# Altium schematic sheet HashUnit1.SchDoc: ANT_Miner_V1.3
size A2; Date: 2013/11/20; DrawnBy: Bitmain Technology; SheetNumber: 6; SheetTotal: 9
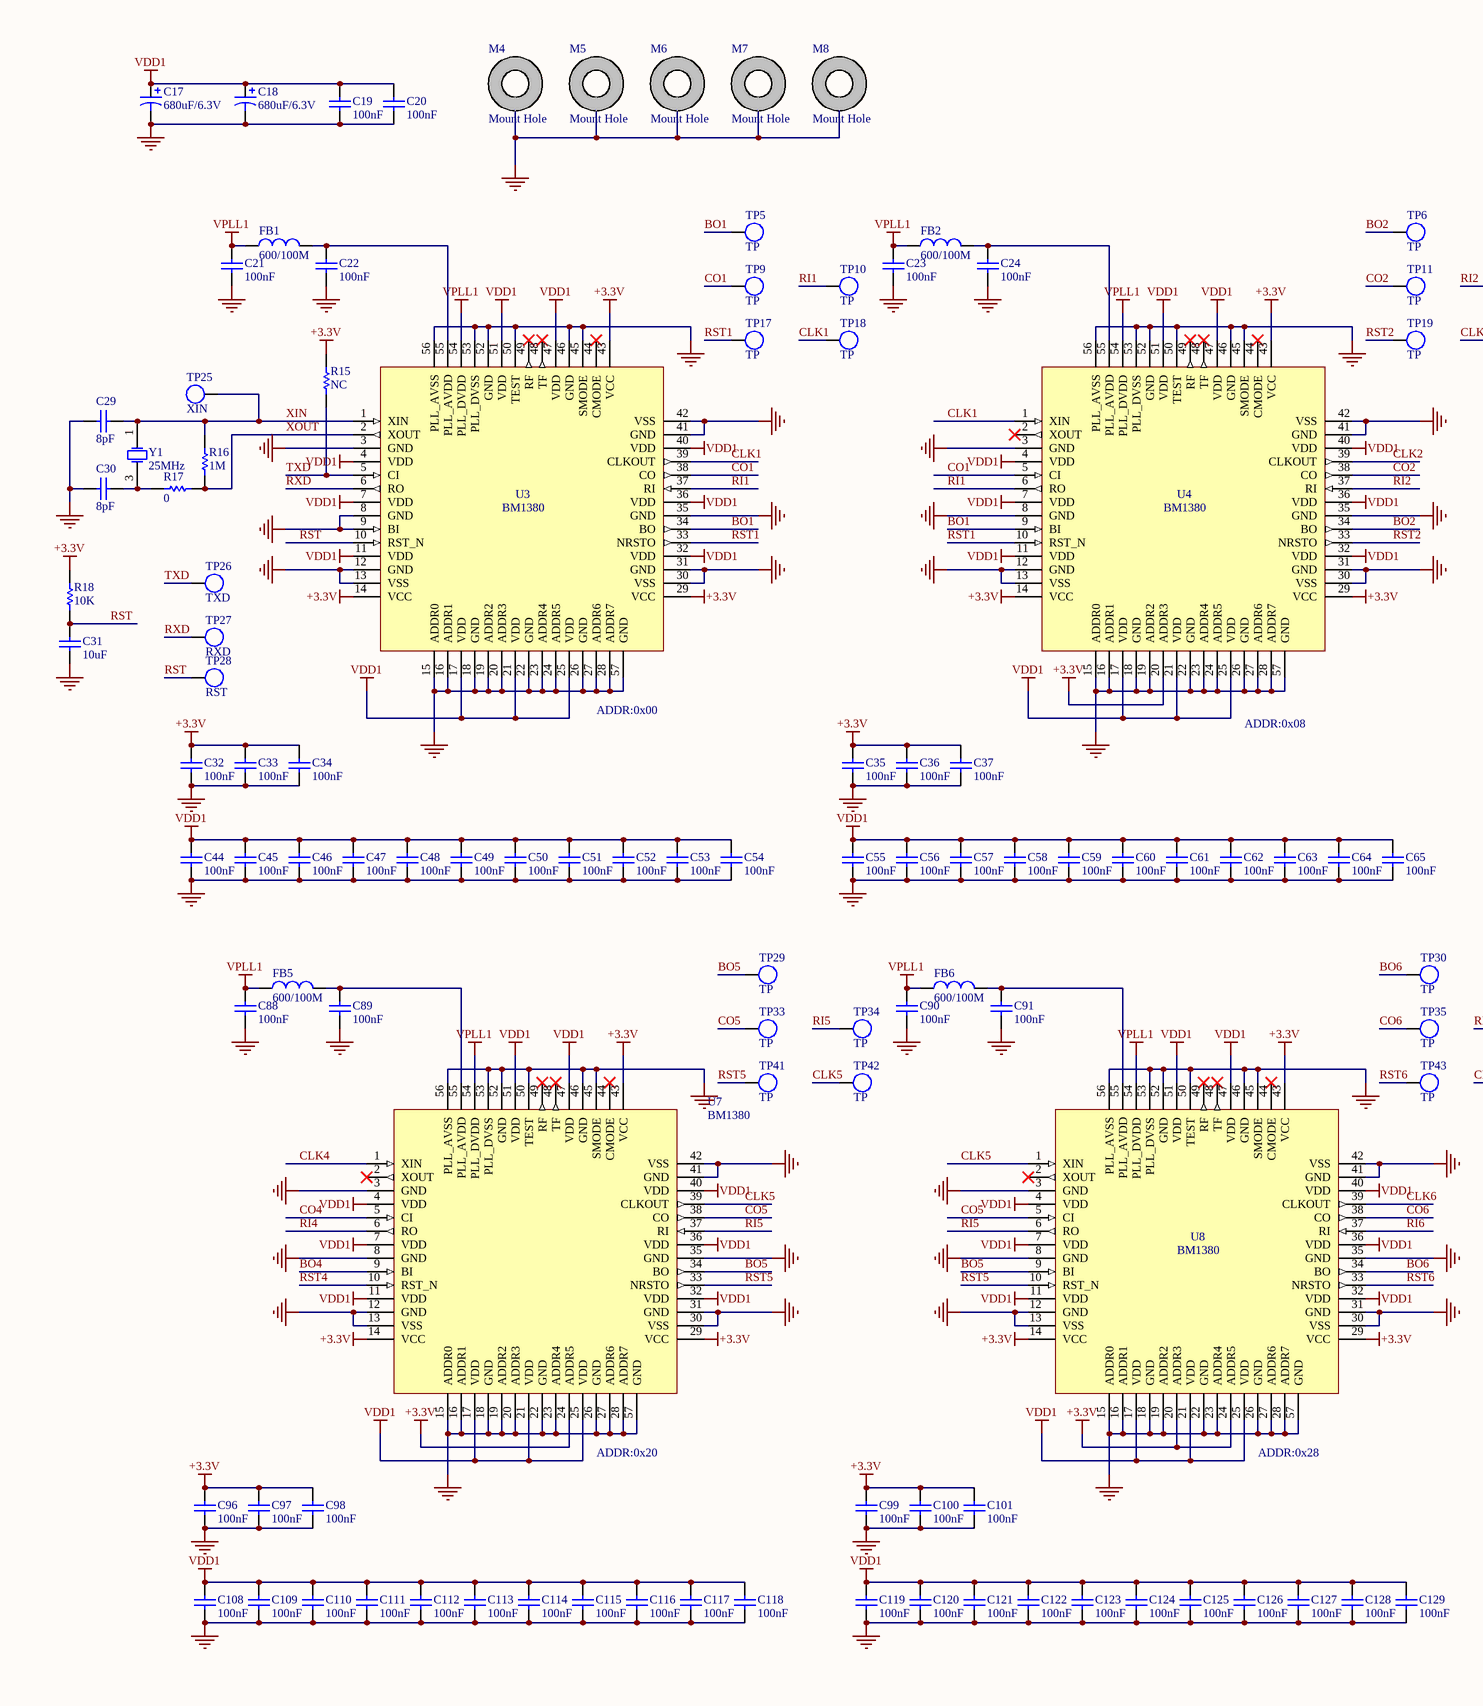
[diagram p0: HashUnit1.SchDoc, left]
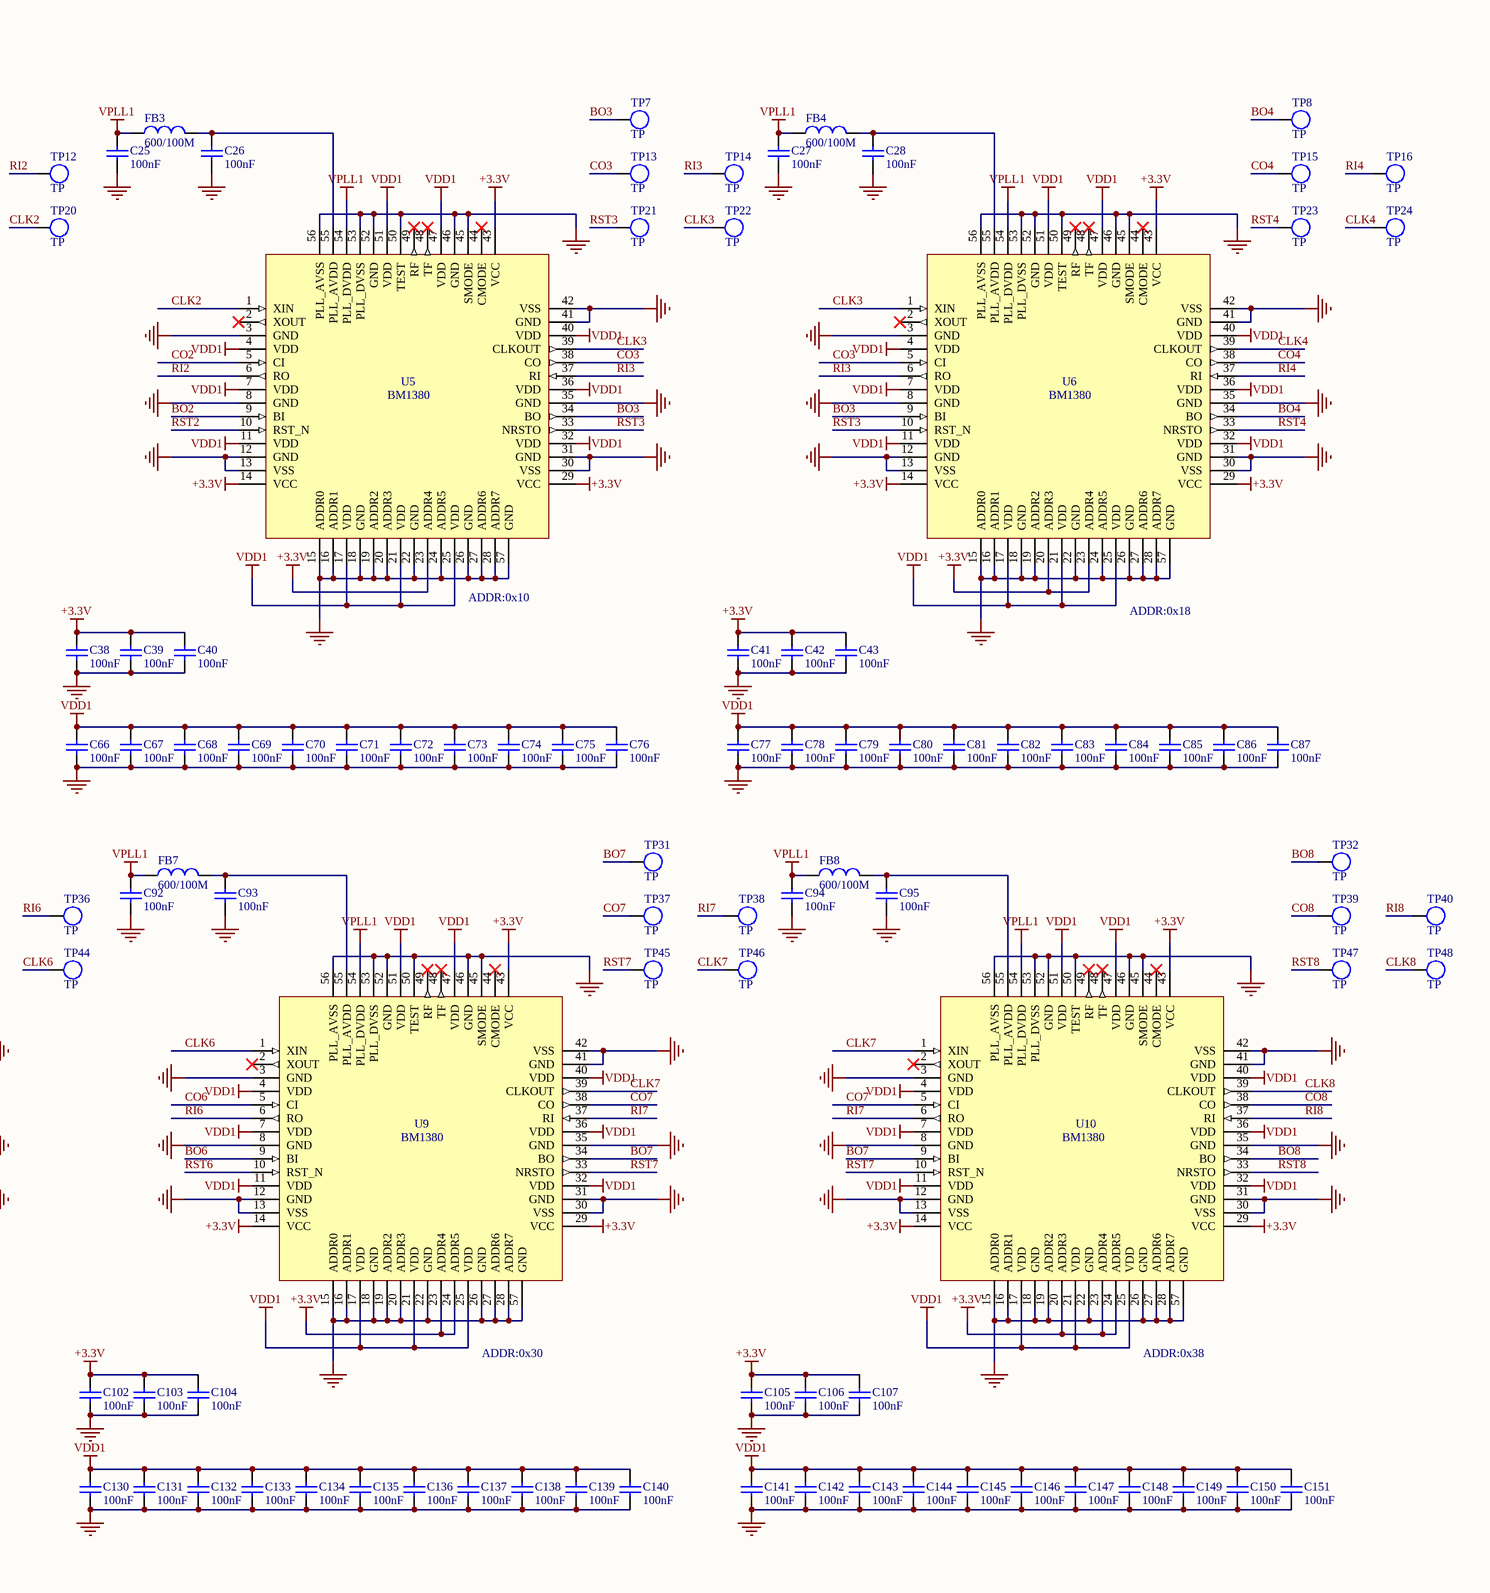
[diagram p1: HashUnit1.SchDoc, right]

## Parts
C17  680uF/6.3V  [D]
C18  680uF/6.3V  [D]
C19  100nF  [CC0603(1608)]
C20  100nF  [CC0603(1608)]
C21  100nF  [CC0603(1608)]
C22  100nF  [CC0603(1608)]
C23  100nF  [CC0603(1608)]
C24  100nF  [CC0603(1608)]
C25  100nF  [CC0603(1608)]
C26  100nF  [CC0603(1608)]
C27  100nF  [CC0603(1608)]
C28  100nF  [CC0603(1608)]
C29  8pF  [CC0603(1608)]
C30  8pF  [CC0603(1608)]
C31  10uF  [CC0603(1608)]
C32  100nF  [CC0603(1608)]
C33  100nF  [CC0603(1608)]
C34  100nF  [CC0603(1608)]
C35  100nF  [CC0603(1608)]
C36  100nF  [CC0603(1608)]
C37  100nF  [CC0603(1608)]
C38  100nF  [CC0603(1608)]
C39  100nF  [CC0603(1608)]
C40  100nF  [CC0603(1608)]
C41  100nF  [CC0603(1608)]
C42  100nF  [CC0603(1608)]
C43  100nF  [CC0603(1608)]
C44  100nF  [CC0603(1608)]
C45  100nF  [CC0603(1608)]
C46  100nF  [CC0603(1608)]
C47  100nF  [CC0603(1608)]
C48  100nF  [CC0603(1608)]
C49  100nF  [CC0603(1608)]
C50  100nF  [CC0603(1608)]
C51  100nF  [CC0603(1608)]
C52  100nF  [CC0603(1608)]
C53  100nF  [CC0603(1608)]
C54  100nF  [CC0603(1608)]
C55  100nF  [CC0603(1608)]
C56  100nF  [CC0603(1608)]
C57  100nF  [CC0603(1608)]
C58  100nF  [CC0603(1608)]
C59  100nF  [CC0603(1608)]
C60  100nF  [CC0603(1608)]
C61  100nF  [CC0603(1608)]
C62  100nF  [CC0603(1608)]
C63  100nF  [CC0603(1608)]
C64  100nF  [CC0603(1608)]
C65  100nF  [CC0603(1608)]
C66  100nF  [CC0603(1608)]
C67  100nF  [CC0603(1608)]
C68  100nF  [CC0603(1608)]
C69  100nF  [CC0603(1608)]
C70  100nF  [CC0603(1608)]
C71  100nF  [CC0603(1608)]
C72  100nF  [CC0603(1608)]
C73  100nF  [CC0603(1608)]
C74  100nF  [CC0603(1608)]
C75  100nF  [CC0603(1608)]
C76  100nF  [CC0603(1608)]
C77  100nF  [CC0603(1608)]
C78  100nF  [CC0603(1608)]
C79  100nF  [CC0603(1608)]
C80  100nF  [CC0603(1608)]
C81  100nF  [CC0603(1608)]
C82  100nF  [CC0603(1608)]
C83  100nF  [CC0603(1608)]
C84  100nF  [CC0603(1608)]
C85  100nF  [CC0603(1608)]
C86  100nF  [CC0603(1608)]
C87  100nF  [CC0603(1608)]
C88  100nF  [CC0603(1608)]
C89  100nF  [CC0603(1608)]
C90  100nF  [CC0603(1608)]
C91  100nF  [CC0603(1608)]
C92  100nF  [CC0603(1608)]
C93  100nF  [CC0603(1608)]
C94  100nF  [CC0603(1608)]
C95  100nF  [CC0603(1608)]
C96  100nF  [CC0603(1608)]
C97  100nF  [CC0603(1608)]
C98  100nF  [CC0603(1608)]
C99  100nF  [CC0603(1608)]
C100  100nF  [CC0603(1608)]
C101  100nF  [CC0603(1608)]
C102  100nF  [CC0603(1608)]
C103  100nF  [CC0603(1608)]
C104  100nF  [CC0603(1608)]
C105  100nF  [CC0603(1608)]
C106  100nF  [CC0603(1608)]
C107  100nF  [CC0603(1608)]
C108  100nF  [CC0603(1608)]
C109  100nF  [CC0603(1608)]
C110  100nF  [CC0603(1608)]
C111  100nF  [CC0603(1608)]
C112  100nF  [CC0603(1608)]
C113  100nF  [CC0603(1608)]
C114  100nF  [CC0603(1608)]
C115  100nF  [CC0603(1608)]
C116  100nF  [CC0603(1608)]
C117  100nF  [CC0603(1608)]
C118  100nF  [CC0603(1608)]
C119  100nF  [CC0603(1608)]
C120  100nF  [CC0603(1608)]
C121  100nF  [CC0603(1608)]
C122  100nF  [CC0603(1608)]
C123  100nF  [CC0603(1608)]
C124  100nF  [CC0603(1608)]
C125  100nF  [CC0603(1608)]
C126  100nF  [CC0603(1608)]
C127  100nF  [CC0603(1608)]
C128  100nF  [CC0603(1608)]
C129  100nF  [CC0603(1608)]
C130  100nF  [CC0603(1608)]
C131  100nF  [CC0603(1608)]
C132  100nF  [CC0603(1608)]
C133  100nF  [CC0603(1608)]
C134  100nF  [CC0603(1608)]
C135  100nF  [CC0603(1608)]
C136  100nF  [CC0603(1608)]
C137  100nF  [CC0603(1608)]
C138  100nF  [CC0603(1608)]
C139  100nF  [CC0603(1608)]
C140  100nF  [CC0603(1608)]
C141  100nF  [CC0603(1608)]
C142  100nF  [CC0603(1608)]
C143  100nF  [CC0603(1608)]
C144  100nF  [CC0603(1608)]
C145  100nF  [CC0603(1608)]
C146  100nF  [CC0603(1608)]
C147  100nF  [CC0603(1608)]
C148  100nF  [CC0603(1608)]
C149  100nF  [CC0603(1608)]
C150  100nF  [CC0603(1608)]
C151  100nF  [CC0603(1608)]
FB1  600/100M  [FB0603(1608)]
FB2  600/100M  [FB0603(1608)]
FB3  600/100M  [FB0603(1608)]
FB4  600/100M  [FB0603(1608)]
FB5  600/100M  [FB0603(1608)]
FB6  600/100M  [FB0603(1608)]
FB7  600/100M  [FB0603(1608)]
FB8  600/100M  [FB0603(1608)]
M4  Mount Hole  [MHOLE2]
M5  Mount Hole  [MHOLE2]
M6  Mount Hole  [MHOLE2]
M7  Mount Hole  [MHOLE2]
M8  Mount Hole  [MHOLE2]
R15  NC  [RR0603(1608)]
R16  1M  [RR0603(1608)]
R17  0  [RR0603(1608)]
R18  10K  [RR0603(1608)]
TP5  TP  [TP_SMD]
TP6  TP  [TP_SMD]
TP7  TP  [TP_SMD]
TP8  TP  [TP_SMD]
TP9  TP  [TP_SMD]
TP10  TP  [TP_SMD]
TP11  TP  [TP_SMD]
TP12  TP  [TP_SMD]
TP13  TP  [TP_SMD]
TP14  TP  [TP_SMD]
TP15  TP  [TP_SMD]
TP16  TP  [TP_SMD]
TP17  TP  [TP_SMD]
TP18  TP  [TP_SMD]
TP19  TP  [TP_SMD]
TP20  TP  [TP_SMD]
TP21  TP  [TP_SMD]
TP22  TP  [TP_SMD]
TP23  TP  [TP_SMD]
TP24  TP  [TP_SMD]
TP25  value XIN  [TP_SMD]  (hidden comment: TP)
TP26  value TXD  [TP_SMD]  (hidden comment: TP)
TP27  value RXD  [TP_SMD]  (hidden comment: TP)
TP28  value RST  [TP_SMD]  (hidden comment: TP)
TP29  TP  [TP_SMD]
TP30  TP  [TP_SMD]
TP31  TP  [TP_SMD]
TP32  TP  [TP_SMD]
TP33  TP  [TP_SMD]
TP34  TP  [TP_SMD]
TP35  TP  [TP_SMD]
TP36  TP  [TP_SMD]
TP37  TP  [TP_SMD]
TP38  TP  [TP_SMD]
TP39  TP  [TP_SMD]
TP40  TP  [TP_SMD]
TP41  TP  [TP_SMD]
TP42  TP  [TP_SMD]
TP43  TP  [TP_SMD]
TP44  TP  [TP_SMD]
TP45  TP  [TP_SMD]
TP46  TP  [TP_SMD]
TP47  TP  [TP_SMD]
TP48  TP  [TP_SMD]
U3  BM1380  [QFN56]
U4  BM1380  [QFN56]
U5  BM1380  [QFN56]
U6  BM1380  [QFN56]
U7  BM1380  [QFN56]
U8  BM1380  [QFN56]
U9  BM1380  [QFN56]
U10  BM1380  [QFN56]
Y1  25MHz  [SMX2]

## Nets
+3.3V: C32.2 C33.2 C34.2 C35.2 C36.2 C37.2 C38.2 C39.2 C40.2 C41.2 C42.2 C43.2 C96.2 C97.2 C98.2 C99.2 C100.2 C101.2 C102.2 C103.2 C104.2 C105.2 C106.2 C107.2 R15.1 R18.2 U3.14(VCC) U3.29(VCC) U3.43(VCC) U4.14(VCC) U4.20(ADDR3) U4.29(VCC) U4.43(VCC) U5.14(VCC) U5.23(ADDR4) U5.29(VCC) U5.43(VCC) U6.14(VCC) U6.20(ADDR3) U6.23(ADDR4) U6.29(VCC) U6.43(VCC) U7.14(VCC) U7.24(ADDR5) U7.29(VCC) U7.43(VCC) U8.14(VCC) U8.20(ADDR3) U8.24(ADDR5) U8.29(VCC) U8.43(VCC) U9.14(VCC) U9.23(ADDR4) U9.24(ADDR5) U9.29(VCC) U9.43(VCC) U10.14(VCC) U10.20(ADDR3) U10.23(ADDR4) U10.24(ADDR5) U10.29(VCC) U10.43(VCC)
GND: C17.2 C18.2 C19.1 C20.1 C21.2 C22.1 C23.2 C24.1 C25.2 C26.1 C27.2 C28.1 C29.2 C30.2 C31.2 C32.1 C33.1 C34.1 C35.1 C36.1 C37.1 C38.1 C39.1 C40.1 C41.1 C42.1 C43.1 C44.1 C45.1 C46.1 C47.1 C48.1 C49.1 C50.1 C51.1 C52.1 C53.1 C54.1 C55.1 C56.1 C57.1 C58.1 C59.1 C60.1 C61.1 C62.1 C63.1 C64.1 C65.1 C66.1 C67.1 C68.1 C69.1 C70.1 C71.1 C72.1 C73.1 C74.1 C75.1 C76.1 C77.1 C78.1 C79.1 C80.1 C81.1 C82.1 C83.1 C84.1 C85.1 C86.1 C87.1 C88.2 C89.1 C90.2 C91.1 C92.2 C93.1 C94.2 C95.1 C96.1 C97.1 C98.1 C99.1 C100.1 C101.1 C102.1 C103.1 C104.1 C105.1 C106.1 C107.1 C108.1 C109.1 C110.1 C111.1 C112.1 C113.1 C114.1 C115.1 C116.1 C117.1 C118.1 C119.1 C120.1 C121.1 C122.1 C123.1 C124.1 C125.1 C126.1 C127.1 C128.1 C129.1 C130.1 C131.1 C132.1 C133.1 C134.1 C135.1 C136.1 C137.1 C138.1 C139.1 C140.1 C141.1 C142.1 C143.1 C144.1 C145.1 C146.1 C147.1 C148.1 C149.1 C150.1 C151.1 M4.0(PIN) M5.0(PIN) M6.0(PIN) M7.0(PIN) M8.0(PIN) U3.3(GND) U3.8(GND) U3.9(BI) U3.12(GND) U3.13(VSS) U3.15(ADDR0) U3.16(ADDR1) U3.18(GND) U3.19(ADDR2) U3.20(ADDR3) U3.22(GND) U3.23(ADDR4) U3.24(ADDR5) U3.26(GND) U3.27(ADDR6) U3.28(ADDR7) U3.30(VSS) U3.31(GND) U3.35(GND) U3.41(GND) U3.42(VSS) U3.45(SMODE) U3.46(GND) U3.50(TEST) U3.52(GND) U3.53(PLL_DVSS) U3.56(PLL_AVSS) U3.57(GND) U4.3(GND) U4.8(GND) U4.12(GND) U4.13(VSS) U4.15(ADDR0) U4.16(ADDR1) U4.18(GND) U4.19(ADDR2) U4.22(GND) U4.23(ADDR4) U4.24(ADDR5) U4.26(GND) U4.27(ADDR6) U4.28(ADDR7) U4.30(VSS) U4.31(GND) U4.35(GND) U4.41(GND) U4.42(VSS) U4.45(SMODE) U4.46(GND) U4.50(TEST) U4.52(GND) U4.53(PLL_DVSS) U4.56(PLL_AVSS) U4.57(GND) U5.3(GND) U5.8(GND) U5.12(GND) U5.13(VSS) U5.15(ADDR0) U5.16(ADDR1) U5.18(GND) U5.19(ADDR2) U5.20(ADDR3) U5.22(GND) U5.24(ADDR5) U5.26(GND) U5.27(ADDR6) U5.28(ADDR7) U5.30(VSS) U5.31(GND) U5.35(GND) U5.41(GND) U5.42(VSS) U5.45(SMODE) U5.46(GND) U5.50(TEST) U5.52(GND) U5.53(PLL_DVSS) U5.56(PLL_AVSS) U5.57(GND) U6.3(GND) U6.8(GND) U6.12(GND) U6.13(VSS) U6.15(ADDR0) U6.16(ADDR1) U6.18(GND) U6.19(ADDR2) U6.22(GND) U6.24(ADDR5) U6.26(GND) U6.27(ADDR6) U6.28(ADDR7) U6.30(VSS) U6.31(GND) U6.35(GND) U6.41(GND) U6.42(VSS) U6.45(SMODE) U6.46(GND) U6.50(TEST) U6.52(GND) U6.53(PLL_DVSS) U6.56(PLL_AVSS) U6.57(GND) U7.3(GND) U7.8(GND) U7.12(GND) U7.13(VSS) U7.15(ADDR0) U7.16(ADDR1) U7.18(GND) U7.19(ADDR2) U7.20(ADDR3) U7.22(GND) U7.23(ADDR4) U7.26(GND) U7.27(ADDR6) U7.28(ADDR7) U7.30(VSS) U7.31(GND) U7.35(GND) U7.41(GND) U7.42(VSS) U7.45(SMODE) U7.46(GND) U7.50(TEST) U7.52(GND) U7.53(PLL_DVSS) U7.56(PLL_AVSS) U7.57(GND) U8.3(GND) U8.8(GND) U8.12(GND) U8.13(VSS) U8.15(ADDR0) U8.16(ADDR1) U8.18(GND) U8.19(ADDR2) U8.22(GND) U8.23(ADDR4) U8.26(GND) U8.27(ADDR6) U8.28(ADDR7) U8.30(VSS) U8.31(GND) U8.35(GND) U8.41(GND) U8.42(VSS) U8.45(SMODE) U8.46(GND) U8.50(TEST) U8.52(GND) U8.53(PLL_DVSS) U8.56(PLL_AVSS) U8.57(GND) U9.3(GND) U9.8(GND) U9.12(GND) U9.13(VSS) U9.15(ADDR0) U9.16(ADDR1) U9.18(GND) U9.19(ADDR2) U9.20(ADDR3) U9.22(GND) U9.26(GND) U9.27(ADDR6) U9.28(ADDR7) U9.30(VSS) U9.31(GND) U9.35(GND) U9.41(GND) U9.42(VSS) U9.45(SMODE) U9.46(GND) U9.50(TEST) U9.52(GND) U9.53(PLL_DVSS) U9.56(PLL_AVSS) U9.57(GND) U10.3(GND) U10.8(GND) U10.12(GND) U10.13(VSS) U10.15(ADDR0) U10.16(ADDR1) U10.18(GND) U10.19(ADDR2) U10.22(GND) U10.26(GND) U10.27(ADDR6) U10.28(ADDR7) U10.30(VSS) U10.31(GND) U10.35(GND) U10.41(GND) U10.42(VSS) U10.45(SMODE) U10.46(GND) U10.50(TEST) U10.52(GND) U10.53(PLL_DVSS) U10.56(PLL_AVSS) U10.57(GND)
VDD1: C17.1 C18.1 C19.2 C20.2 C44.2 C45.2 C46.2 C47.2 C48.2 C49.2 C50.2 C51.2 C52.2 C53.2 C54.2 C55.2 C56.2 C57.2 C58.2 C59.2 C60.2 C61.2 C62.2 C63.2 C64.2 C65.2 C66.2 C67.2 C68.2 C69.2 C70.2 C71.2 C72.2 C73.2 C74.2 C75.2 C76.2 C77.2 C78.2 C79.2 C80.2 C81.2 C82.2 C83.2 C84.2 C85.2 C86.2 C87.2 C108.2 C109.2 C110.2 C111.2 C112.2 C113.2 C114.2 C115.2 C116.2 C117.2 C118.2 C119.2 C120.2 C121.2 C122.2 C123.2 C124.2 C125.2 C126.2 C127.2 C128.2 C129.2 C130.2 C131.2 C132.2 C133.2 C134.2 C135.2 C136.2 C137.2 C138.2 C139.2 C140.2 C141.2 C142.2 C143.2 C144.2 C145.2 C146.2 C147.2 C148.2 C149.2 C150.2 C151.2 U3.4(VDD) U3.7(VDD) U3.11(VDD) U3.17(VDD) U3.21(VDD) U3.25(VDD) U3.32(VDD) U3.36(VDD) U3.40(VDD) U3.47(VDD) U3.51(VDD) U4.4(VDD) U4.7(VDD) U4.11(VDD) U4.17(VDD) U4.21(VDD) U4.25(VDD) U4.32(VDD) U4.36(VDD) U4.40(VDD) U4.47(VDD) U4.51(VDD) U5.4(VDD) U5.7(VDD) U5.11(VDD) U5.17(VDD) U5.21(VDD) U5.25(VDD) U5.32(VDD) U5.36(VDD) U5.40(VDD) U5.47(VDD) U5.51(VDD) U6.4(VDD) U6.7(VDD) U6.11(VDD) U6.17(VDD) U6.21(VDD) U6.25(VDD) U6.32(VDD) U6.36(VDD) U6.40(VDD) U6.47(VDD) U6.51(VDD) U7.4(VDD) U7.7(VDD) U7.11(VDD) U7.17(VDD) U7.21(VDD) U7.25(VDD) U7.32(VDD) U7.36(VDD) U7.40(VDD) U7.47(VDD) U7.51(VDD) U8.4(VDD) U8.7(VDD) U8.11(VDD) U8.17(VDD) U8.21(VDD) U8.25(VDD) U8.32(VDD) U8.36(VDD) U8.40(VDD) U8.47(VDD) U8.51(VDD) U9.4(VDD) U9.7(VDD) U9.11(VDD) U9.17(VDD) U9.21(VDD) U9.25(VDD) U9.32(VDD) U9.36(VDD) U9.40(VDD) U9.47(VDD) U9.51(VDD) U10.4(VDD) U10.7(VDD) U10.11(VDD) U10.17(VDD) U10.21(VDD) U10.25(VDD) U10.32(VDD) U10.36(VDD) U10.40(VDD) U10.47(VDD) U10.51(VDD)
VPLL1: C21.1 C23.1 C25.1 C27.1 C88.1 C90.1 C92.1 C94.1 FB1.2 FB2.2 FB3.2 FB4.2 FB5.2 FB6.2 FB7.2 FB8.2 U3.54(PLL_DVDD) U4.54(PLL_DVDD) U5.54(PLL_DVDD) U6.54(PLL_DVDD) U7.54(PLL_DVDD) U8.54(PLL_DVDD) U9.54(PLL_DVDD) U10.54(PLL_DVDD)
BO1: TP5.1 U3.34(BO) U4.9(BI)
BO2: TP6.1 U4.34(BO) U5.9(BI)
BO3: TP7.1 U5.34(BO) U6.9(BI)
BO4: TP8.1 U6.34(BO) U7.9(BI)
BO5: TP29.1 U7.34(BO) U8.9(BI)
BO6: TP30.1 U8.34(BO) U9.9(BI)
BO7: TP31.1 U9.34(BO) U10.9(BI)
BO8: TP32.1 U10.34(BO)
CLK1: TP18.1 U3.39(CLKOUT) U4.1(XIN)
CLK2: TP20.1 U4.39(CLKOUT) U5.1(XIN)
CLK3: TP22.1 U5.39(CLKOUT) U6.1(XIN)
CLK4: TP24.1 U6.39(CLKOUT) U7.1(XIN)
CLK5: TP42.1 U7.39(CLKOUT) U8.1(XIN)
CLK6: TP44.1 U8.39(CLKOUT) U9.1(XIN)
CLK7: TP46.1 U9.39(CLKOUT) U10.1(XIN)
CLK8: TP48.1 U10.39(CLKOUT)
CO1: TP9.1 U3.38(CO) U4.5(CI)
CO2: TP11.1 U4.38(CO) U5.5(CI)
CO3: TP13.1 U5.38(CO) U6.5(CI)
CO4: TP15.1 U6.38(CO) U7.5(CI)
CO5: TP33.1 U7.38(CO) U8.5(CI)
CO6: TP35.1 U8.38(CO) U9.5(CI)
CO7: TP37.1 U9.38(CO) U10.5(CI)
CO8: TP39.1 U10.38(CO)
RI1: TP10.1 U3.37(RI) U4.6(RO)
RI2: TP12.1 U4.37(RI) U5.6(RO)
RI3: TP14.1 U5.37(RI) U6.6(RO)
RI4: TP16.1 U6.37(RI) U7.6(RO)
RI5: TP34.1 U7.37(RI) U8.6(RO)
RI6: TP36.1 U8.37(RI) U9.6(RO)
RI7: TP38.1 U9.37(RI) U10.6(RO)
RI8: TP40.1 U10.37(RI)
RST: C31.1 R18.1 TP28.1 U3.10(RST_N)
RST1: TP17.1 U3.33(NRSTO) U4.10(RST_N)
RST2: TP19.1 U4.33(NRSTO) U5.10(RST_N)
RST3: TP21.1 U5.33(NRSTO) U6.10(RST_N)
RST4: TP23.1 U6.33(NRSTO) U7.10(RST_N)
RST5: TP41.1 U7.33(NRSTO) U8.10(RST_N)
RST6: TP43.1 U8.33(NRSTO) U9.10(RST_N)
RST7: TP45.1 U9.33(NRSTO) U10.10(RST_N)
RST8: TP47.1 U10.33(NRSTO)
RXD: TP27.1 U3.6(RO)
TXD: R15.2 TP26.1 U3.5(CI)
XIN: C29.1 R16.2 TP25.1 U3.1(XIN) Y1.1(OSC1)
XOUT: R16.1 R17.1 U3.2(XOUT)
NetC22_2: C22.2 FB1.1 U3.55(PLL_AVDD)
NetC24_2: C24.2 FB2.1 U4.55(PLL_AVDD)
NetC26_2: C26.2 FB3.1 U5.55(PLL_AVDD)
NetC28_2: C28.2 FB4.1 U6.55(PLL_AVDD)
NetC30_1: C30.1 R17.2 Y1.3(OSC2)
NetC89_2: C89.2 FB5.1 U7.55(PLL_AVDD)
NetC91_2: C91.2 FB6.1 U8.55(PLL_AVDD)
NetC93_2: C93.2 FB7.1 U9.55(PLL_AVDD)
NetC95_2: C95.2 FB8.1 U10.55(PLL_AVDD)

Not connected (* = marked no-connect by the designer): U3 44(CMODE)* 48(TF)* 49(RF)*; U4 2(XOUT)* 44(CMODE)* 48(TF)* 49(RF)*; U5 2(XOUT)* 44(CMODE)* 48(TF)* 49(RF)*; U6 2(XOUT)* 44(CMODE)* 48(TF)* 49(RF)*; U7 2(XOUT)* 44(CMODE)* 48(TF)* 49(RF)*; U8 2(XOUT)* 44(CMODE)* 48(TF)* 49(RF)*; U9 2(XOUT)* 44(CMODE)* 48(TF)* 49(RF)*; U10 2(XOUT)* 44(CMODE)* 48(TF)* 49(RF)*

## Notes on the sheet
- ADDR:0x00
- ADDR:0x08
- ADDR:0x10
- ADDR:0x18
- ADDR:0x20
- ADDR:0x28
- ADDR:0x30
- ADDR:0x38

## Library data of the parts
C17 C18 = T492C: Solid Tantalum Chip Capacitor, T492 Series - CWR11 Style Per Mil-PRF-55365/8; Published: 17-Jul-2002; LatestRevisionDate: 19-Mar-2004; LatestRevisionNote: Silkscreen dimensions re-sized.; DatasheetDocument: Mar-2001; PackageDocument: Mar-2001; PackageReference: C; Publisher: Altium Limited; Code_JEITA: 6032-28; ComponentLink1Description: Manufacturer Link; ComponentLink1URL: http://www.kemet.com/; ComponentLink2Description: Datasheet; ComponentLink2URL: http://www.kemet.com/kemet/web/homepage/kechome.nsf/vapubfilesname/F3102TA.pdf/$file/F3102TA.pdf; Value: 680uF/6.3V
C19 C20 = Cap Semi: Capacitor (Semiconductor SIM Model); Published: 8-Jun-2000; LatestRevisionDate: 29-May-2009; LatestRevisionNote: IPC-7351 Footprint Added.; PackageReference: C1206; Publisher: Altium Limited; PackageDescription: Chip Capacitor; Value: 100nF
C21-C151 = Cap: Capacitor; Published: 8-Jun-2000; LatestRevisionDate: 17-Jul-2002; LatestRevisionNote: Re-released for DXP Platform.; PackageReference: RAD-0.3; Publisher: Altium Limited; PackageDescription: Radial Cap, Thru-Hole; 2 Leads; 0.3 in Pin Spacing
  C21-C28 C32-C151: Value: 100nF
  C29 C30: Value: 8pF
  C31: Value: 10uF
FB1-FB8 = FB: Inductor; Code_IEC: 1005; Published: 8-Jun-2000; LatestRevisionDate: 29-May-2009; LatestRevisionNote: IPC-7351 Footprint Added.; PackageReference: 0402-A; Publisher: Altium Limited; PackageDescription: Chip Inductor; Code_JEITA: 0402; Value: 600/100M
M4-M8 = M_Hole
R15-R18 = Res1: Resistor; Published: 8-Jun-2000; LatestRevisionDate: 17-Jul-2002; LatestRevisionNote: Re-released for DXP Platform.; PackageReference: AXIAL-0.3; Publisher: Altium Limited; PackageDescription: Axial Device, Thru-Hole; 2 Leads; 0.3 in Pin Spacing
  R15: Value: NC
  R16: Value: 1M
  R17: Value: 0
  R18: Value: 10K
TP5-TP48 = TP: Test Point
  TP5-TP24 TP29-TP48: Value: TP
Y1 = XTAL: Crystal Oscillator; Published: 8-Jun-2000; LatestRevisionDate: 17-Jul-2002; LatestRevisionNote: Re-released for DXP Platform.; PackageReference: R38; Publisher: Altium Limited; PackageDescription: Crystal, Thru-Hole; 2 Leads; Body 3.1 x 8.2 mm (Dia.xH); Value: 25MHz